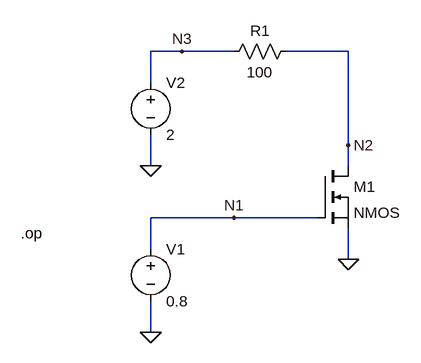
[diagram p0: schematic nMOS_Common_Source.asc]
nMOS_Common_Source.asc, the LTspice schematic file:
Version 4.1
SHEET 1 880 680
WIRE -80 -288 -128 -288
WIRE 0 -288 -80 -288
WIRE 176 -288 80 -288
WIRE -128 -240 -128 -288
WIRE 176 -144 176 -288
WIRE -128 -112 -128 -160
WIRE 176 -112 176 -144
WIRE 0 -32 -128 -32
WIRE 128 -32 0 -32
WIRE -128 16 -128 -32
WIRE 176 32 176 -16
WIRE -128 144 -128 96
FLAG -128 144 0
FLAG 176 32 0
FLAG 0 -32 N1
FLAG 176 -144 N2
FLAG -128 -112 0
FLAG -80 -288 N3
SYMBOL voltage -128 0 R0
WINDOW 123 0 0 Left 0
WINDOW 39 0 0 Left 0
SYMATTR InstName V1
SYMATTR Value 0.8
SYMBOL nmos 128 -112 R0
SYMATTR InstName M1
SYMBOL res 96 -304 R90
WINDOW 0 0 56 VBottom 2
WINDOW 3 32 56 VTop 2
SYMATTR InstName R1
SYMATTR Value 100
SYMBOL voltage -128 -256 R0
WINDOW 123 0 0 Left 0
WINDOW 39 0 0 Left 0
SYMATTR InstName V2
SYMATTR Value 2
TEXT -328 -8 Left 2 !.op

The netlist it stands for:
* nMOS_Common_Source.asc
V1 N1 0 0.8
M1 N2 N1 0 0 NMOS
R1 N2 N3 100
V2 N3 0 2
.model NMOS NMOS
.model PMOS PMOS
.lib standard.mos
.op
.backanno
.end

* Results of the author's LTspice run, read from the files saved beside the schematic
* Operating Point:
*   V(n1) = 800 mV
*   V(n2) = 1.999 V
*   V(n3) = 2 V
*   I(R1) = -6.4 µA
*   I(V1) = 0 A
*   I(V2) = -6.4 µA
*   Ib(M1) = -2.009 pA
*   Id(M1) = 6.4 µA
*   Ig(M1) = 0 A
*   Is(M1) = -6.4 µA